# Altium schematic sheet Clock Thru.SchDoc
size 297 x 209 mm; CompanyName: Sainsbury Wellcome Centre; Organization: FabLab; Address1: Sainsbury Wellcome Centre; Address2: 25 Howland Street; Address3: London; Address4: W1T 4JG; DocumentNumber: 14; SheetNumber: 14; SheetTotal: 14; swcgroup: FabLab; Org: Sainsbury Wellcome Centre; Add1: 25 Howland Street; Add2: London; Add3: W1T 4JG; WebAddress: www.sainsburywellcome.org; SheetSize: A4; SheetName: Clock Thru
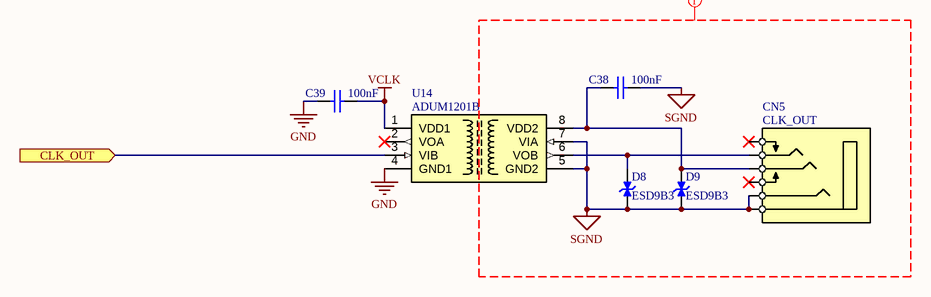
[diagram p0: Clock Thru.SchDoc]

## Parts
C38  value 100nF  [CAP_CHIP_0603]  (hidden comment: C0603-100nF-50V)
C39  value 100nF  [CAP_CHIP_0603]  (hidden comment: C0603-100nF-50V)
CN5  CLK_OUT  [PJ-316A]
D8  ESD9B3  [SOD923]
D9  ESD9B3  [SOD923]
U14  ADUM1201B  [SOIC8]

## Ports
CLK_OUT (in)

## Nets
GND: C39.2 U14.4(GND1)
SGND: C38.1 CN5.1(S) CN5.4(RR) D8.1(K) D9.1(K) U14.5(GND2) U14.7(VIA)
VCLK: C39.1 U14.1(VDD1)
CLK_OUT: U14.3(VIB) ; port CLK_OUT
NetC38_2: C38.2 CN5.3(R) D9.2(A) U14.8(VDD2)
NetCN5_2: CN5.2(T) D8.2(A) U14.6(VOB)

Not connected (* = marked no-connect by the designer): CN5 5(TS)* 6(RS)*; U14 2(VOA)*

## Layout directives
mark named Isolated Output: SGND

## Notes on the sheet
- FILE
- VARIANT
- DATE
- REVISION
- SHEET
- /
- PROJECT
- SIZE

## Library data of the parts
C38 C39 = CMP-611-0027-24: 0603 Multilayer Ceramic Capacitors MLCC; PartNumber: CC0603KRX7R9BB104; Voltage Rating: 50V; Pick&PlaceFootprint: C0603; Dielectric: X7R; Tolerance: 10%; LCSC Part N.: C14663; Capacitor Type: Ceramic; Case/Package: 0603; RoHS: Yes; Mount: SMD
CN5 = CMP-380-0019-5: 3.5mm headphone jack 235℃ 30V 500mA SMD Audio Connector; PartNumber: PJ-316A-6A; Gender: Female; IEC Conformance: No; Mount: Through Hole; LCSC Part N.: C128987; Orientation: Horizontal; Pitch: 3.5mm
D8 D9 = CMP-210-0004-2: ESD9B3.3ST5G, Bi-Directional TVS Diode, 300mW, 2-Pin SOD-923; Stand-off Voltage: 3.3V; Pick&PlaceFootprint: SOT-23; Breakdown Voltage: 5V; Clamp Voltage: 11.5V; LCSC Part N.: C96512; PartNumber: ESD9B3.3ST5G
U14 = CMP-930-0008-4: General Purpose Digital Isolator 2500Vrms 2 Channel 10Mbps 25kV/µs CMTI 8-SOIC (0.154; PartNumber: ADUM1201BRZ-RL7; Min Supply Voltage: 2.7V; Max Supply Voltage: 5.5V; Data Rate: 25Mbps; Pick&PlaceFootprint: SOIC8; LCSC Part N.: C87626